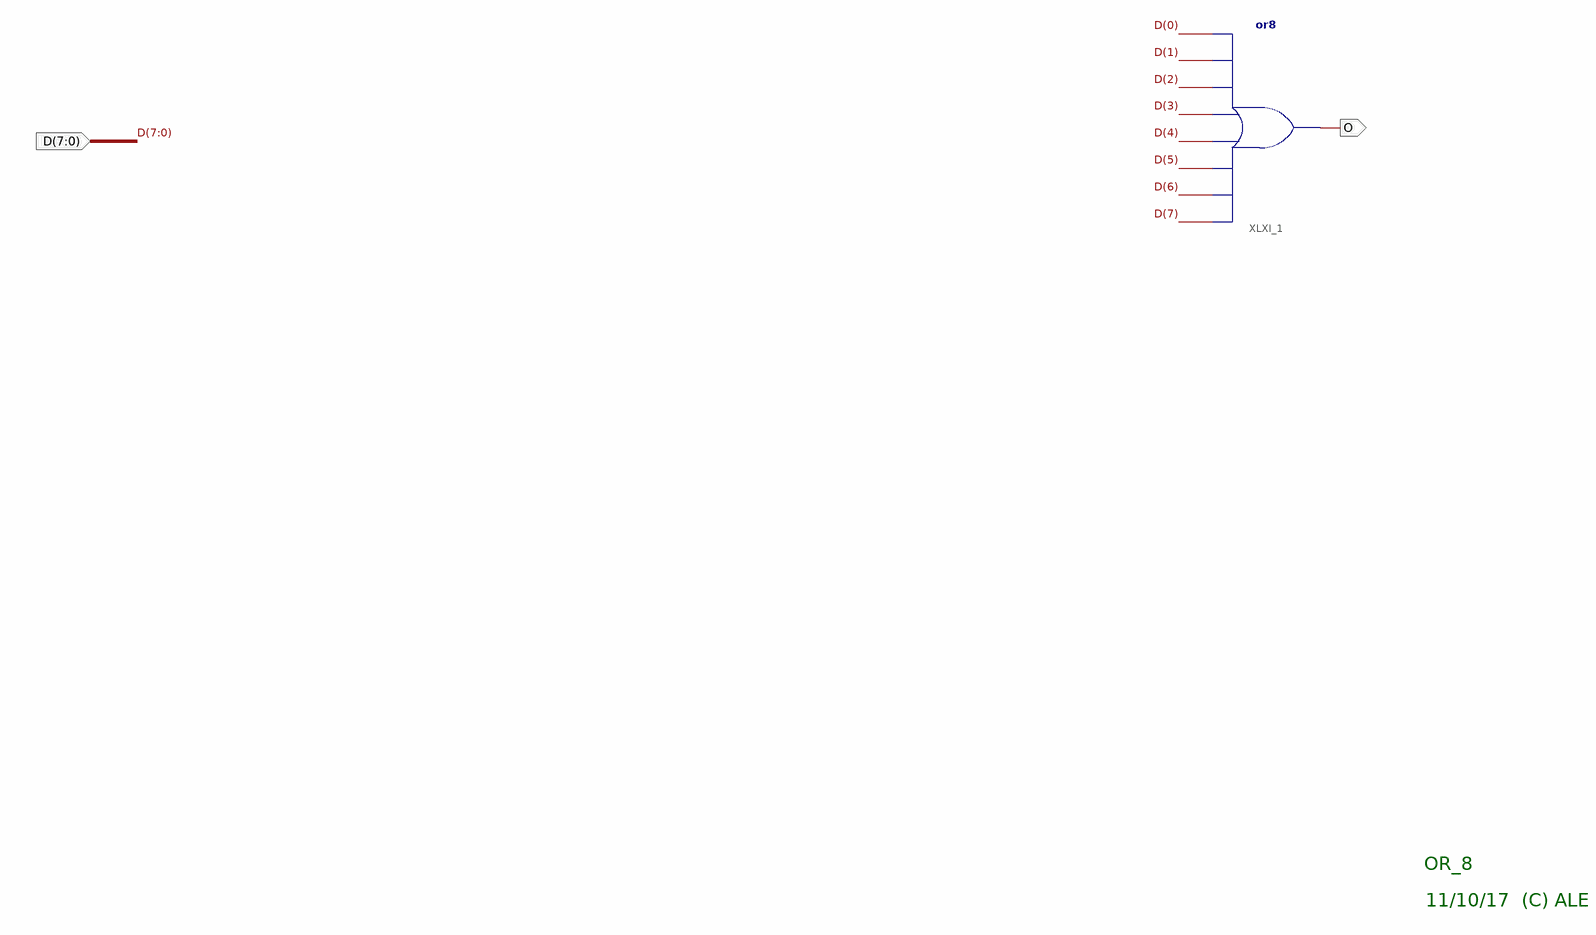
[diagram p0: schematic sheet 1]
// Xilinx ISE schematic Or_8.sch (zynq) as structural Verilog: 1 symbols, 2 ports
module Or_8 (
  input  [7:0] D,
  output O
);

  or XLXI_1 (O, D[7], D[6], D[5], D[4], D[3], D[2], D[1], D[0]);

  // Notes on the sheet:
  //   OR_8
  //   11/10/17  (C) ALE
endmodule
